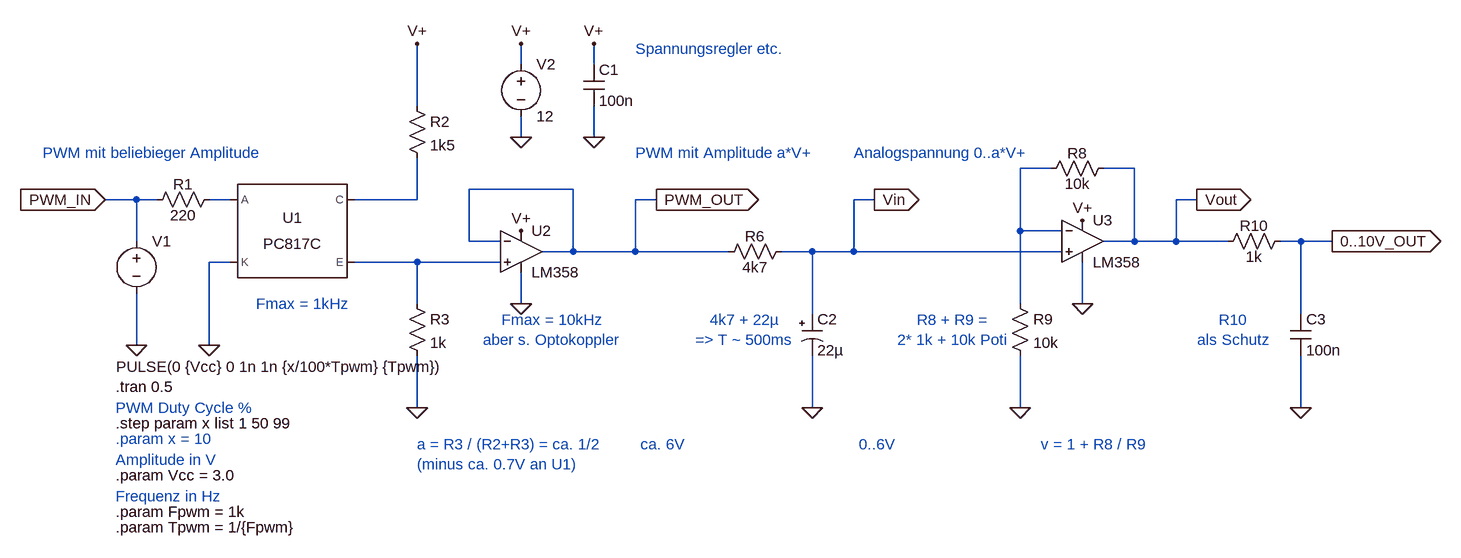
[diagram p0: schematic Draft3 PWM mit OpAmp.asc]
Draft3 PWM mit OpAmp.asc, the LTspice schematic file:
Version 4
SHEET 1 1196 680
WIRE -320 -64 -320 -96
WIRE -208 -64 -208 -96
WIRE -480 0 -480 -96
WIRE -320 48 -320 16
WIRE -208 48 -208 0
WIRE 496 96 448 96
WIRE 624 96 576 96
WIRE -240 128 -400 128
WIRE -912 144 -960 144
WIRE -880 144 -912 144
WIRE -768 144 -800 144
WIRE -480 144 -480 80
WIRE -480 144 -576 144
WIRE -112 144 -144 144
WIRE 224 144 192 144
WIRE 720 144 688 144
WIRE 448 192 448 96
WIRE 512 192 448 192
WIRE -912 208 -912 144
WIRE -400 208 -400 128
WIRE -352 208 -400 208
WIRE 624 208 624 96
WIRE 624 208 576 208
WIRE 688 208 688 144
WIRE 688 208 624 208
WIRE 768 208 688 208
WIRE 880 208 848 208
WIRE 928 208 880 208
WIRE -240 224 -240 128
WIRE -240 224 -288 224
WIRE -144 224 -144 144
WIRE -144 224 -240 224
WIRE 0 224 -144 224
WIRE 128 224 80 224
WIRE 192 224 192 144
WIRE 192 224 128 224
WIRE 512 224 192 224
WIRE -768 240 -800 240
WIRE -480 240 -576 240
WIRE -352 240 -480 240
WIRE -480 304 -480 240
WIRE -320 304 -320 256
WIRE 448 304 448 192
WIRE 544 304 544 240
WIRE 128 320 128 224
WIRE 880 320 880 208
WIRE -912 368 -912 288
WIRE -800 368 -800 240
WIRE -480 464 -480 384
WIRE 128 464 128 384
WIRE 448 464 448 384
WIRE 880 464 880 384
FLAG -912 368 0
FLAG -320 48 0
FLAG 928 208 0..10V_OUT
IOPIN 928 208 Out
FLAG 128 464 0
FLAG -320 192 V+
FLAG -320 -96 V+
FLAG 544 176 V+
FLAG -960 144 PWM_IN
IOPIN -960 144 In
FLAG -800 368 0
FLAG -480 464 0
FLAG -480 -96 V+
FLAG -112 144 PWM_OUT
IOPIN -112 144 Out
FLAG 448 464 0
FLAG 224 144 Vin
IOPIN 224 144 Out
FLAG 720 144 Vout
IOPIN 720 144 Out
FLAG -320 304 0
FLAG 544 304 0
FLAG 880 464 0
FLAG -208 48 0
FLAG -208 -96 V+
SYMBOL voltage -912 192 R0
WINDOW 123 0 0 Left 0
WINDOW 39 0 0 Left 0
WINDOW 3 -31 209 Left 2
SYMATTR Value PULSE(0 {Vcc} 0 1n 1n {x/100*Tpwm} {Tpwm})
SYMATTR InstName V1
SYMBOL voltage -320 -80 R0
WINDOW 123 0 0 Left 0
WINDOW 39 0 0 Left 0
SYMATTR InstName V2
SYMATTR Value 12
SYMBOL OpAmps\\LM358 544 144 R0
SYMATTR InstName U3
SYMBOL res 96 208 R90
WINDOW 0 8 56 VBottom 2
WINDOW 3 24 56 VTop 2
SYMATTR InstName R6
SYMATTR Value 4k7
SYMBOL OpAmps\\LM358 -320 160 R0
SYMATTR InstName U2
SYMBOL res -784 128 R90
WINDOW 0 8 56 VBottom 2
WINDOW 3 24 56 VTop 2
SYMATTR InstName R1
SYMATTR Value 220
SYMBOL Optos\\PC817C -672 192 R0
SYMATTR InstName U1
SYMBOL res -496 -16 R0
SYMATTR InstName R2
SYMATTR Value 1k5
SYMBOL res -496 288 R0
SYMATTR InstName R3
SYMATTR Value 1k
SYMBOL res 432 288 R0
SYMATTR InstName R9
SYMATTR Value 10k
SYMBOL res 592 80 R90
WINDOW 0 8 56 VBottom 2
WINDOW 3 24 56 VTop 2
SYMATTR InstName R8
SYMATTR Value 10k
SYMBOL res 864 192 R90
WINDOW 0 8 56 VBottom 2
WINDOW 3 24 56 VTop 2
SYMATTR InstName R10
SYMATTR Value 1k
SYMBOL cap 864 320 R0
SYMATTR InstName C3
SYMATTR Value 100n
SYMBOL polcap 112 320 R0
SYMATTR InstName C2
SYMATTR Value 22µ
SYMBOL cap -224 -64 R0
SYMATTR InstName C1
SYMATTR Value 100n
TEXT -944 432 Left 2 !.tran 0.5
TEXT -944 488 Left 2 !.step param x list 1 50 99
TEXT -944 464 Left 2 ;PWM Duty Cycle %
TEXT -944 568 Left 2 !.param Vcc = 3.0
TEXT -944 648 Left 2 !.param Tpwm = 1/{Fpwm}
TEXT -944 624 Left 2 !.param Fpwm = 1k
TEXT -944 600 Left 2 ;Frequenz in Hz
TEXT -944 544 Left 2 ;Amplitude in V
TEXT -944 512 Left 2 ;.param x = 10
TEXT -1056 72 Left 2 ;PWM mit beliebieger Amplitude
TEXT -144 72 Left 2 ;PWM mit Amplitude a*V+
TEXT 192 72 Left 2 ;Analogspannung 0..a*V+
TEXT 480 520 Left 2 ;v = 1 + R8 / R9
TEXT -480 520 Left 2 ;a = R3 / (R2+R3) = ca. 1/2\n(minus ca. 0.7V an U1)
TEXT -136 520 Left 2 ;ca. 6V
TEXT 200 520 Left 2 ;0..6V
TEXT -728 304 Left 2 ;Fmax = 1kHz
TEXT 24 344 Center 2 ;4k7 + 22µ\n=> T ~ 500ms
TEXT -272 344 Center 2 ;Fmax = 10kHz\naber s. Optokoppler
TEXT 344 344 Center 2 ;R8 + R9 =\n2* 1k + 10k Poti
TEXT 776 344 Center 2 ;R10\nals Schutz
TEXT -144 -88 Left 2 ;Spannungsregler etc.

The netlist it stands for:
* Draft3 PWM mit OpAmp.asc
V1 PWM_IN 0 PULSE(0 {Vcc} 0 1n 1n {x/100*Tpwm} {Tpwm})
V2 V+ 0 12
XU3 Vin N001 V+ 0 Vout LM358  ; pins In+ In- V+ V- OUT
R6 Vin PWM_OUT 4k7
XU2 N004 PWM_OUT V+ 0 PWM_OUT LM358  ; pins In+ In- V+ V- OUT
R1 N002 PWM_IN 220
XU1 N002 0 N003 N004 PC817 Igain=2.3m  ; PC817C, pins A K C E
R2 V+ N003 1k5
R3 N004 0 1k
R9 N001 0 10k
R8 Vout N001 10k
R10 0..10V_OUT Vout 1k
C3 0..10V_OUT 0 100n
C2 Vin 0 22µ
C1 V+ 0 100n
.tran 0.5
.step param x list 1 50 99
* PWM Duty Cycle %
.param Vcc = 3.0
.param Tpwm = 1/{Fpwm}
.param Fpwm = 1k
* Frequenz in Hz
* Amplitude in V
* .param x = 10
* PWM mit beliebieger Amplitude
* PWM mit Amplitude a*V+
* Analogspannung 0..a*V+
* v = 1 + R8 / R9
* a = R3 / (R2+R3) = ca. 1/2
* (minus ca. 0.7V an U1)
* ca. 6V
* 0..6V
* Fmax = 1kHz
* 4k7 + 22µ
* => T ~ 500ms
* Fmax = 10kHz
* aber s. Optokoppler
* R8 + R9 =
* 2* 1k + 10k Poti
* R10
* als Schutz
* Spannungsregler etc.
.lib PC817.sub
.backanno
.end